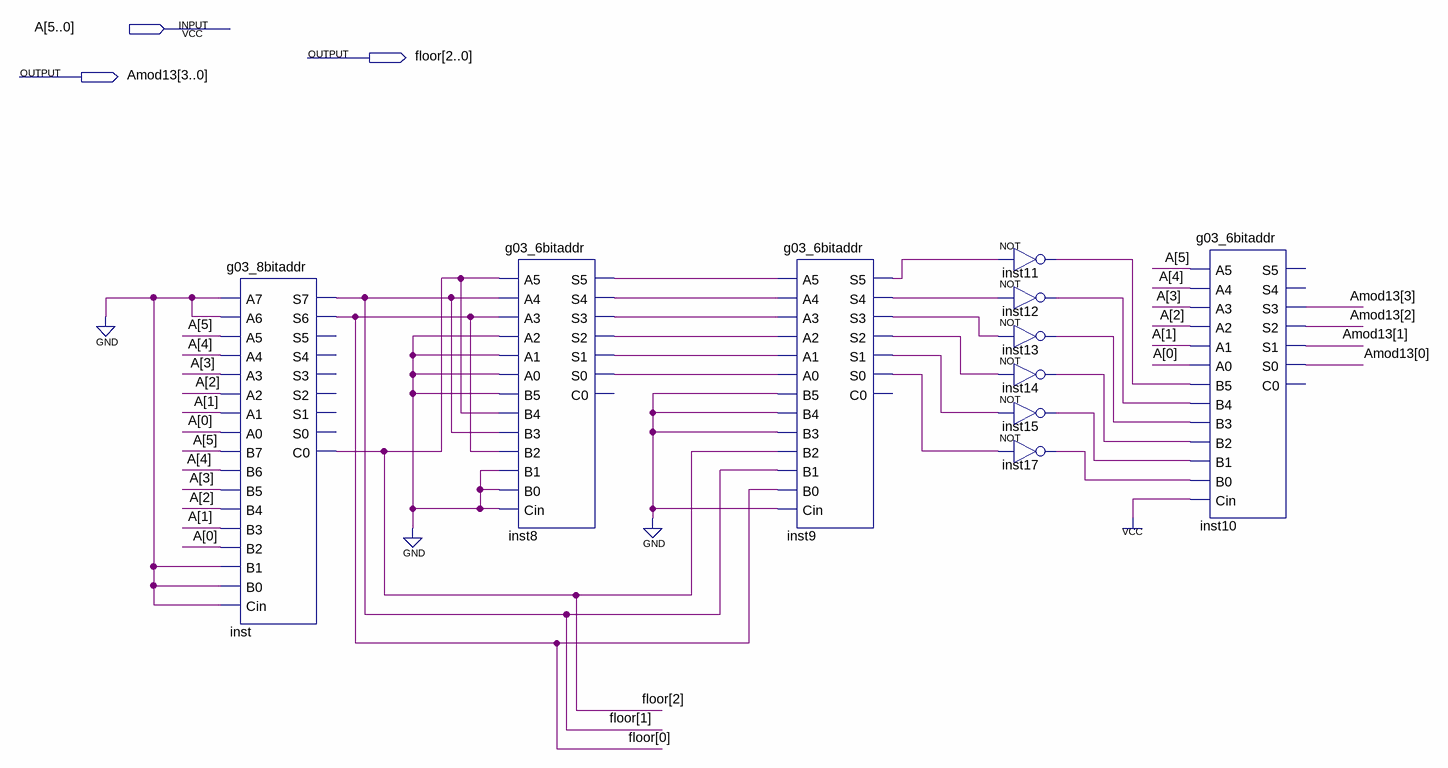
[diagram p0: schematic sheet]
// Quartus schematic g03_mod13.bdf as structural Verilog: 10 symbols, 3 pins
module g03_mod13 (
  input  [5:0] A,
  output [2:0] floor,
  output [3:0] Amod13
);

  wire inst8_s0, inst8_s1, inst8_s2, inst8_s3, inst8_s4, inst8_s5, inst9_s0, inst9_s1, inst9_s2, inst9_s3,
       inst9_s4, inst9_s5, inst11_out, inst12_out, inst13_out, inst14_out, inst15_out, inst17_out;

  g03_8bitaddr inst (
    .A7(1'b0), .A6(1'b0), .A5(A[5]), .A4(A[4]), .A3(A[3]), .A2(A[2]), .A1(A[1]), .A0(A[0]), .B7(A[5]),
    .B6(A[4]), .B5(A[3]), .B4(A[2]), .B3(A[1]), .B2(A[0]), .B1(1'b0), .B0(1'b0), .Cin(1'b0), .S7(floor[1]),
    .S6(floor[0]), .C0(floor[2]));  // open: S5, S4, S3, S2, S1, S0
  g03_6bitaddr inst8 (
    .A5(floor[2]), .A4(floor[1]), .A3(floor[0]), .A2(1'b0), .A1(1'b0), .A0(1'b0), .B5(1'b0), .B4(floor[2]),
    .B3(floor[1]), .B2(floor[0]), .B1(1'b0), .B0(1'b0), .Cin(1'b0), .S5(inst8_s5), .S4(inst8_s4),
    .S3(inst8_s3), .S2(inst8_s2), .S1(inst8_s1), .S0(inst8_s0));  // open: C0
  g03_6bitaddr inst9 (
    .A0(inst8_s0), .A1(inst8_s1), .A2(inst8_s2), .A3(inst8_s3), .A4(inst8_s4), .A5(inst8_s5), .B0(floor[0]),
    .B1(floor[1]), .B2(floor[2]), .B3(1'b0), .B4(1'b0), .B5(1'b0), .Cin(1'b0), .S0(inst9_s0), .S1(inst9_s1),
    .S2(inst9_s2), .S3(inst9_s3), .S4(inst9_s4), .S5(inst9_s5));  // open: C0
  not inst11 (inst11_out, inst9_s5);
  not inst12 (inst12_out, inst9_s4);
  not inst13 (inst13_out, inst9_s3);
  not inst14 (inst14_out, inst9_s2);
  not inst15 (inst15_out, inst9_s1);
  not inst17 (inst17_out, inst9_s0);
  g03_6bitaddr inst10 (
    .A5(A[5]), .A4(A[4]), .A3(A[3]), .A2(A[2]), .A1(A[1]), .A0(A[0]), .B5(inst11_out), .B4(inst12_out),
    .B3(inst13_out), .B2(inst14_out), .B1(inst15_out), .B0(inst17_out), .Cin(1'b1), .S3(Amod13[3]),
    .S2(Amod13[2]), .S1(Amod13[1]), .S0(Amod13[0]));  // open: S5, S4, C0
endmodule
